# Altium project Soldeer_Station_Seppe_budenaers.PrjPcb
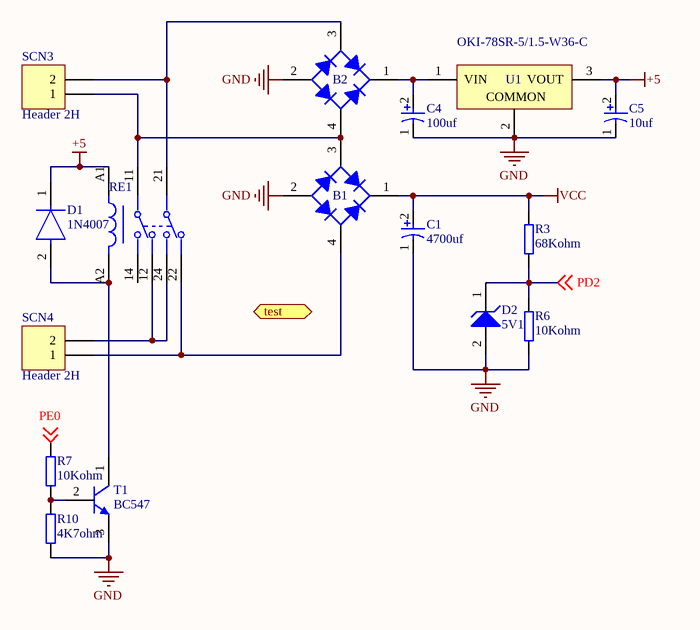
[diagram p0: Voeding.SchDoc]
ME: Seppe Budenaers; PR_number: PXLEAI1001; PR_title: Soldeerstation
5 sheets, 73 parts. Net scope: flat (ports and power ports of the same name join across sheets).
Board file: PCB1.PcbDoc
Sheets:
  Voeding.SchDoc
  Microcontroler.SchDoc
  Soldeerbout_out.SchDoc
  Thermokoppel.SchDoc
  Display.SchDoc

## Sheet Voeding.SchDoc: Soldeerstation
size A4; SheetNumber: 1; SheetTotal: 5

### Parts
B1  Bridge_Rectifier  [ttf]  (value not drawn)
B2  Bridge_Rectifier  [ttf]  (value not drawn)
C1  4700uf  [CE_D25_L25_THT]
C4  100uf  [CE_D8_L10]
C5  10uf  [CE_D4_L5,4]
D1  1N4007  [SOD-123FL]
D2  5V1  [SOD-123FL]
R3  68Kohm  [R_0805_M]
R6  10Kohm  [R_0805_M]
R7  10Kohm  [R_0805_M]
R10  4K7ohm  [R_0805_M]
RE1  RELAY_GENERAL_PURPOSE  [RT42]  (value not drawn)
SCN3  Header 2H  [Connector_2x1_p_5mm]
SCN4  Header 2H  [Connector_2x1_p_5mm]
T1  BC547  [SOT_23]
U1  OKI-78SR-5/1.5-W36-C  [OKI78SR515W36C]

### Ports
test (bidir)

### Nets
+5: C5.2 D1.1(C) RE1.A1 U1.3(VOUT)
GND: B1.2(A) B2.2(A) C1.1 C4.1 C5.1 D2.2(A) R6.2 R10.2 T1.3(E) U1.2(COMMON)
VCC: B1.1(K) C1.2 R3.2
PD2: D2.1(K) R3.1 R6.1 ; off-sheet PD2
PE0: R7.2 ; off-sheet PE0
NetB1_3: B1.3(C) B2.4(C) RE1.11 SCN3.1
NetB1_4: B1.4(C) RE1.22 SCN4.1
NetB2_1: B2.1(K) C4.2 U1.1(VIN)
NetB2_3: B2.3(C) RE1.21 SCN3.2
NetD1_2: D1.2(A) RE1.A2 T1.1(C)
NetR7_1: R7.1 R10.1 T1.2(B)
NetRE1_12: RE1.12 RE1.24 SCN4.2

Not connected (* = marked no-connect by the designer): RE1 14

### Library data of the parts
B1 B2 = Bridge_Rectifier: Manufacturer: Diodes Inc; Average Rectified Current-Max: 0.8A; Reverse Voltage-Max [Vrrm]: 600V; Forward Voltage: 1V; Peak Current-Max: 30A; Reverse Current-Max: 5µA; Package Version: 05/2016; Package URL: http://www.diodes.com/_files/packages/MiniDIP.pdf; Datasheet Version: Rev. 13-2, 12/2010; Datasheet URL: http://www.diodes.com/_files/datasheets/ds17003.pdf; Mounting Technology: SurfaceMount; Manufacturer URL: http://www.diodes.com/; Package Reference: MiniDIP-4; Package Description: 4-Pin Small Outline Integrated Circuit, Body 4.7 x 3.8 mm, Pitch 2.5 mm
C1 C4 C5 = Capacitor_Electrolytic: Manufacturer: Panasonic; Voltage Rating: 25 V; ComponentLink2URL: http://industrial.panasonic.com/cdbs/www-data/pdf/RDE0000/ABA0000C1181.pdf; Height: 10.2 mm; Max Operating Temperature: 105 degC; PackageReference: EEE-FK1E221P; ComponentLink1Description: Manufacturer URL; ComponentLink1URL: http://www.panasonic.com/; Mount: Surface Mount; REACH SVHC: No SVHC; Min Operating Temperature: -55 degC; ComponentLink2Description: Datasheet; DatasheetVersion: 03/2016; Length: 10.2 mm; RoHSCompliant: true; Packaging: Tape and Reel; Package Quantity: 500; Lead Pitch: 3.1 mm; Pins: 2; PackageDescription: 2-Pin Electrolytic Aluminum Capacitor, Body 8.3 x 8.3 mm; Mounting Technology: Surface Mount
D1 = Diode: Manufacturer: Diotec; Max Surge Forward Current: 27A; Forward Current: 1A; Max Junction Temp: +175°C; Reverse Voltage: 1000V; Value: 15pF; Peak Reverse Current: 5uA; Category: Diode; Temperature Range Low: -50°C; Automotive: No; Temperature: -50°C to +175°C; Lead Free: Yes; ComponentLink2Description: Datasheet; Max Repetitive Reverse Voltage: 1000V; ComponentLink2URL: https://datasheet.octopart.com/1N4007-Diotec-datasheet-62346875.pdf; Manufacturer Part Number: 1N4007; Device Class L3: Rectifier Diodes; Height: 2.8mm; Octopart: https://octopart.com/1n4007-diotec-4040411; Package: 1N4007; Temperature Range High: +175°C; Device Class L1: Discrete Semiconductors; Device Class L2: Diodes; RoHS: TRUE; Capacitance: 15pF; Ipc Land Pattern Name: DIOAD888W100L520D280
D2 = Zener_Diode: Manufacturer: On Semiconductor; PartNumber: 1SMB5920BT3G; Packing: Tape and Reel; VZ Typ (V): 6.2; PackageDescription: 2-Pin Small Molded Package, J-Bend Lead, Body 4.33 x 3.625 mm; Mounting Technology: Surface Mount; PackageVersion: Rev. H, 05/2011; ComponentLink1Description: Manufacturer URL; RoHS: Pb-Free; DatasheetVersion: Rev. 8; ComponentLink2Description: Datasheet; ComponentLink2URL: http://www.onsemi.com/pub_link/Collateral/1SMB5913BT3-D.PDF; ComponentLink1URL: http://www.onsemi.com/; ComponentLink3Description: Package Specification; PackageReference: SMB-2-403A-03_H; ComponentLink3URL: http://www.onsemi.com/pub_link/Collateral/1SMB5913BT3-D.PDF
R3 R6 R7 R10 = Resistor: Manufacturer: Vishay Dale; Part Number: CRCW08050000Z0EA
RE1 = RELAY_GENERAL_PURPOSE: Manufacturer Part Number: RT424005; Manufacturer: TE Connectivity; Coil Power: 403mW; Throw Configuration: DPDT; Coil Voltage: 5V; Number Of Contacts: 2; Coil Resistance: 62Ω; Current Rating: 8A; Coil Type: Non-Latching; Category: Relay; Octopart: https://octopart.com/5-1393243-9-te+connectivity-41835766; Device Class L3: Power Relays; ComponentLink2URL: https://www.te.com/commerce/DocumentDelivery/DDEController?Action=showdoc&DocId=Data+Sheet%7FRT2%7F1014%7Fpdf%7FEnglish%7FENG_DS_RT2_1014.pdf%7F5-1393243-9; Ambient Temperature Range High: +85°C; ComponentLink2Description: Datasheet; Digikey Description: RELAY GENERAL PURPOSE DPDT 8A 5V; Package: RT424005; Automotive: No; Device Class L1: Electromechanical; Height: 15.7mm; Device Class L2: Relays; Ambient Temperature Range Low: -40°C; Mouser Description: General Purpose Relay, Rt2 Series, Power, Non Latching, Dpdt, 5 Vdc, 8 A Rohs Compliant: Yes; Lead Free: Yes; RoHS: TRUE
SCN3 SCN4 = Header 2H: ScrewConnector, 2-Pin, Right Angle; LatestRevisionDate: 17-Jul-2002; LatestRevisionNote: Re-released for DXP Platform.; Publisher: Altium Limited
T1 = Transistor_NPN: Manufacturer: On Semiconductor; PartNumber: BC547C; IC Continuous (A): 0.1; fT Min (MHz): 150; Packing: Bulk Box; Polarity: NPN; Mounting Technology: Through Hole; ComponentLink1URL: http://www.onsemi.com/; ComponentLink1Description: Manufacturer URL; ComponentLink3URL: http://www.onsemi.cn/pub_link/Collateral/2N6426-D.PDF; DatasheetVersion: Rev. 7; PackageVersion: Rev. AM; RoHS: FALSE; ComponentLink2URL: http://www.onsemi.com/pub_link/Collateral/BC546-D.PDF; ComponentLink3Description: Package Specification; PackageDescription: 3-Pin Transistor Outline, Body 4.825 x 3.685 mm, Pitch 1.27 mm; PackageReference: TO-92-3-29-11_AM_SL; ComponentLink2Description: Datasheet
U1 = DC/DC Converter: Manufacturer: Murata; Current - Output (Max): 1.5A; Power (Watts) - Max: 8W; Efficiency: 90.5%; Voltage - Input (Min): 7V; Voltage - Input (Max): 36V; Voltage - Output 1: 5V; Number of Outputs: 1; Package / Case: 3-SIPModule; Features: SCP; Type: LinearRegulatorReplacement; Size / Dimension: 0.41"Lx0.30"Wx0.65"H(10.4mmx7.6mmx16.5mm); Datasheet URL: https://datasheet.ciiva.com/8006/1790439-8006672.pdf; Datasheet Version: Oct-13; Power (Watts) - Manufacture Series: 8W; Voltage - Output 2: -; Series: Okami™OKI-78SR; Family: DCDCConverters; Manufacturer URL: http://www.murata.com/; Category: PowerSupplies-BoardMount; Voltage - Isolation: -; Packaging: Tube; Applications: ITE(Commercial); Mounting Type: ThroughHole; Voltage - Output 3: -; Operating Temperature: -40degC~85degC

## Sheet Microcontroler.SchDoc: Soldeerstation
size A4; SheetNumber: 2; SheetTotal: 5
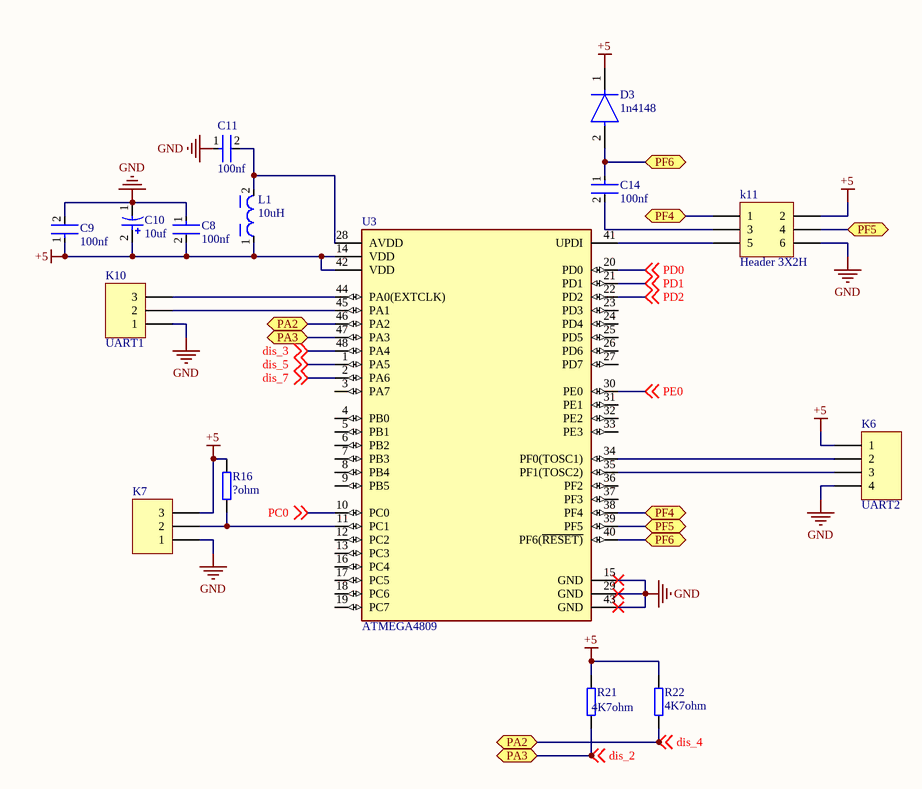
[diagram p1: Microcontroler.SchDoc]

### Parts
C8  100nf  [CC_0805_m]
C9  100nf  [CC_0805_m]
C10  10uf  [CE_D4_L5,4]
C11  100nf  [CC_0805_m]
C14  100nf  [CC_0805_m]
D3  1n4148  [SOD-123FL]
K6  UART2  [MHDR1X4]
K7  Header 3H  [MHDR1X3]  (value not drawn)
K10  UART1  [MHDR1X3]
k11  Header 3X2H  [MHDR2X3]
L1  10uH  [CC_0805_L]
R16  ?ohm  [R_0805_M]
R21  4K7ohm  [R_0805_M]
R22  4K7ohm  [R_0805_M]
U3  ATMEGA4809  [TQFP_48_M]

### Ports
PA2 (bidir), PA3 (bidir), PF4 (bidir), PF5 (bidir), PF6 (bidir)

### Nets
+5: C8.2 C9.1 C10.2 D3.1(C) K6.1 K7.3 k11.2 L1.1 R16.2 R21.2 R22.2 U3.14(VDD) U3.42(VDD)
GND: C8.1 C9.2 C10.1 C11.1 K6.4 K7.1 K10.1 k11.6 U3.15(GND) U3.29(GND) U3.43(GND)
dis_2: R21.1 U3.47(PA3) ; off-sheet dis_2, port PA3
dis_3: U3.48(PA4) ; off-sheet dis_3
dis_4: R22.1 U3.46(PA2) ; off-sheet dis_4, port PA2
dis_5: U3.1(PA5) ; off-sheet dis_5
dis_7: U3.2(PA6) ; off-sheet dis_7
PC0: U3.10(PC0) ; off-sheet PC0
PD0: U3.20(PD0) ; off-sheet PD0
PD1: U3.21(PD1) ; off-sheet PD1
PD2: U3.22(PD2) ; off-sheet PD2
PE0: U3.30(PE0) ; off-sheet PE0
NetC11_2: C11.2 L1.2 U3.28(AVDD)
NetC14_1: C14.1 D3.2(A) U3.40(PF6(~{RESET)}) ; port PF6
NetC14_2: C14.2 k11.3
NetK6_2: K6.2 U3.34(PF0(TOSC1))
NetK6_3: K6.3 U3.35(PF1(TOSC2))
NetK7_2: K7.2 R16.1 U3.11(PC1)
NetK10_2: K10.2 U3.45(PA1)
NetK10_3: K10.3 U3.44(PA0(EXTCLK))
Netk11_1: k11.1 U3.38(PF4) ; port PF4
Netk11_4: k11.4 U3.39(PF5) ; port PF5
Netk11_5: k11.5 U3.41(UPDI)

Not connected (* = marked no-connect by the designer): U3 3(PA7) 4(PB0) 5(PB1) 6(PB2) 7(PB3) 8(PB4) 9(PB5) 12(PC2) 13(PC3) 16(PC4) 17(PC5) 18(PC6) 19(PC7) 23(PD3) 24(PD4) 25(PD5) 26(PD6) 27(PD7) 31(PE1) 32(PE2) 33(PE3) 36(PF2) 37(PF3)

### Library data of the parts
C8 C9 C11 C14 = Capacitor_Ceramic: Manufacturer: KEMET; Manufacturer Part Number: C0805C224K5RACTU; Value: 0.22 μF; Temperature Characteristic: X7R; Temperature Coefficient: 30ppm/°C; Tolerance: 0.1; Voltage Rating: 50 V; ComponentLink2URL: https://content.kemet.com/datasheets/KEM_C1003_C0G_SMD.pdf; Device Class L3: Ceramic Capacitors; Lead Free: Yes; Temperature: -55°C to +125°C; RoHS: TRUE; Capacitance: 0.22 μF; Automotive: No; Material: Ceramic; Octopart: https://octopart.com/c0805c224k5ractu-kemet-144670; Temperature Range Low: -55°C; Height: 0.88mm; Device Class L1: Passive Components; Digikey Description: CAP CER 0.22UF 50V X7R 0805; ComponentLink2Description: Datasheet; Mouser Description: CAP CER 0.22UF 50V X7R 0805; Category: Cap; Ipc Land Pattern Name: CAPC200125X78; Temperature Range High: +125°C; Package: C0805C-DN; Device Class L2: Capacitors
C10 = Capacitor_Electrolytic: as C1 on sheet Voeding; ComponentLink2URL: http://industrial.panasonic.com/cdbs/www-data/pdf/RDE0000/ABA0000C1181.pdf; Height: 10.2 mm; Max Operating Temperature: 105 degC; PackageReference: EEE-FK1E221P; ComponentLink1Description: Manufacturer URL; ComponentLink1URL: http://www.panasonic.com/; Mount: Surface Mount; REACH SVHC: No SVHC; Min Operating Temperature: -55 degC; ComponentLink2Description: Datasheet; DatasheetVersion: 03/2016; Length: 10.2 mm; RoHSCompliant: true; Packaging: Tape and Reel; Package Quantity: 500; Lead Pitch: 3.1 mm; Pins: 2; PackageDescription: 2-Pin Electrolytic Aluminum Capacitor, Body 8.3 x 8.3 mm; Mounting Technology: Surface Mount
D3 = Diode: Manufacturer Part Number: 1N4007; Manufacturer: Diotec; Max Surge Forward Current: 27A; Forward Current: 1A; Max Junction Temp: +175°C; Reverse Voltage: 1000V; Value: 15pF; Peak Reverse Current: 5uA; Category: Diode; Temperature Range Low: -50°C; Automotive: No; Temperature: -50°C to +175°C; Lead Free: Yes; ComponentLink2Description: Datasheet; Max Repetitive Reverse Voltage: 1000V; ComponentLink2URL: https://datasheet.octopart.com/1N4007-Diotec-datasheet-62346875.pdf; Device Class L3: Rectifier Diodes; Height: 2.8mm; Octopart: https://octopart.com/1n4007-diotec-4040411; Package: 1N4007; Temperature Range High: +175°C; Device Class L1: Discrete Semiconductors; Device Class L2: Diodes; RoHS: TRUE; Capacitance: 15pF; Ipc Land Pattern Name: DIOAD888W100L520D280
K6 = Header 4H: Header, 4-Pin, Right Angle; LatestRevisionDate: 17-Jul-2002; LatestRevisionNote: Re-released for DXP Platform.; Publisher: Altium Limited
K7 K10 = Header 3H: Header, 3-Pin, Right Angle; LatestRevisionDate: 17-Jul-2002; LatestRevisionNote: Re-released for DXP Platform.; Publisher: Altium Limited
k11 = Header 3X2H: Header, 3-Pin, Dual row, Right Angle; LatestRevisionDate: 17-Jul-2002; LatestRevisionNote: Re-released for DXP Platform.; Publisher: Altium Limited
L1 = Choke: Tolerance: 20%; Shielding: Shielded; Saturation Current: 10A; Test Frequency: 100kHz; RMS Current (Irms): 8.5A; Series Resistance: 14.1R; DC Resistance (DCR): 14.1mR; Self Resonant Frequency: 18MHz; Ratings: AEC-Q200; Width: 12.8mm; Series: WE-HCI; Length: 0.512inch; Mount: Surface Mount; Resistor Type: Wirewound; RoHS Compliant: Yes; Inductance: 10uH; Package Quantity: 1; Min Operating Temperature: -40°C; Inductance Tolerance: 20%; Termination: SMD/SMT; Max DC Current: 8.5A; Height - Seated (Max): 0.197inch; Case/Package: 1350; Current Rating: 8.5A; Max Operating Temperature: 155°C; Packaging: Tape and Reel; Height: 4.7mm
R16 R21 R22 = Resistor: as R3 on sheet Voeding
U3 = ATMEGA4809: Peripherals: Brown-out Detect/Reset; Number of I/Os: 41; Core Architecture: AVR; Memory Size: 48KB; Interface: I2C; Oscillator Type: Internal; Memory Type: FLASH; Series: megaAVR® 0, Functional Safety (FuSa); Min Operating Temperature: -40°C; Mount: Surface Mount; Case/Package: TQFP; RoHS Compliant: Yes; Max Operating Temperature: 85°C

## Sheet Soldeerbout_out.SchDoc: Soldeerstation
size A4; SheetNumber: 3; SheetTotal: 5
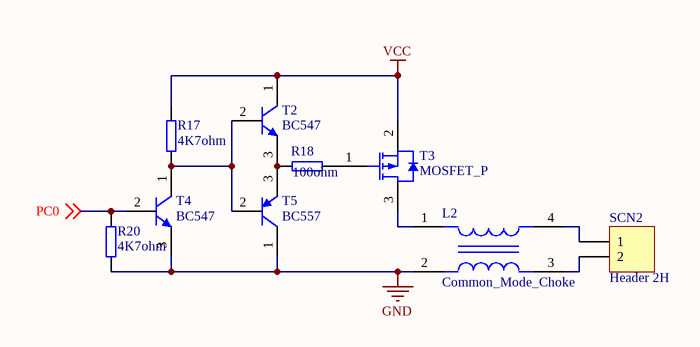
[diagram p2: Soldeerbout_out.SchDoc]

### Parts
L2  Common_Mode_Choke  [2545]
R17  4K7ohm  [R_0805_M]
R18  100ohm  [R_0805_M]
R20  4K7ohm  [R_0805_M]
SCN2  Header 2H  [Connector_2x1_p_5mm]
T2  BC547  [SOT_23]
T3  MOSFET_P  [TO_252]
T4  BC547  [SOT_23]
T5  BC557  [SOT_23]

### Nets
GND: L2.2 R20.1 T4.3(E) T5.1(C)
VCC: R17.2 T2.1(C) T3.2(SOURCE)
PC0: R20.2 T4.2(B) ; off-sheet PC0
NetL2_1: L2.1 T3.3(DRAIN)
NetL2_3: L2.3 SCN2.2
NetL2_4: L2.4 SCN2.1
NetR17_1: R17.1 T2.2(B) T4.1(C) T5.2(B)
NetR18_1: R18.1 T2.3(E) T5.3(E)
NetR18_2: R18.2 T3.1(GATE)

### Library data of the parts
L2 = Common_Mode_Choke: Max Current Rating: 2A; Number of Lines: 2; Impedance: 900R; Element Configuration: Dual; Insulation Resistance: 10MR; Test Frequency: 100MHz; DC Resistance (DCR): 60mR; Voltage Rating (DC): 50V; Current Rating: 2.3A; Number of Pins: 4; DC Current: 2A; Mount: Surface Mount; Current: 2A; REACH SVHC: No SVHC; Width: 4.5mm; Case/Package: 1808; Voltage Rating: 50V; Package Quantity: 1; Height: 2mm; Max DC Current: 2A; Packaging: Tape and Reel; Max Operating Temperature: 85°C; Lead Free: Lead Free; Length: 0.185inch; Series: ACM; Radiation Hardening: No; Max Voltage Rating (DC): 50V; Termination: Flat; Depth: 4.7mm; RoHS Compliant: Yes; DC Resistance-Max: 60mR; Min Operating Temperature: -40°C
R17 R18 R20 = Resistor: as R3 on sheet Voeding
SCN2 = Header 2H: screwconnector, 2-Pin, Right Angle; LatestRevisionDate: 17-Jul-2002; LatestRevisionNote: Re-released for DXP Platform.; Publisher: Altium Limited
T2 T4 = Transistor_NPN: as T1 on sheet Voeding; Mounting Technology: Through Hole; ComponentLink1URL: http://www.onsemi.com/; ComponentLink1Description: Manufacturer URL; ComponentLink3URL: http://www.onsemi.cn/pub_link/Collateral/2N6426-D.PDF; DatasheetVersion: Rev. 7; PackageVersion: Rev. AM; RoHS: FALSE; ComponentLink2URL: http://www.onsemi.com/pub_link/Collateral/BC546-D.PDF; ComponentLink3Description: Package Specification; PackageDescription: 3-Pin Transistor Outline, Body 4.825 x 3.685 mm, Pitch 1.27 mm; PackageReference: TO-92-3-29-11_AM_SL; ComponentLink2Description: Datasheet
T3 = MOSFET_P: Manufacturer: Fairchild Semiconductor; Reel Quantity: 3000; Drain Source Voltage Vds: 20V; Power Dissipation Pd: 500mW; On Resistance Rds(on): 52mohm; Full Power Rating Temperature: 25°C; Voltage Vgs Max: -800mV; Pulse Current Idm: 10A; Rds(on) Test Voltage Vgs: -4.5V; External Depth: 2.5mm; Transistor Case Style: SOT-23; No. of Pins: 3; Continuous Drain Current Id: 2.4A; Voltage Vds Typ: -20V; Voltage Vgs th Max: -1.5V; Transistor Polarity: PChannel; Package Version: Rev. 3, 05/2015; External Width: 3.05mm; External Length / Height: 1.12mm; SMD Marking: 304P; SVHC: NoSVHC(19-Dec-2012); Termination Type: SMD; Datasheet URL: https://www.fairchildsemi.com/datasheets/FD/FDN304P.pdf; Tape Width: 8mm; Mounting Technology: SurfaceMount; Voltage Vgs Rds on Measurement: -4.5V; Operating Temperature Range: -55°Cto+150°C; Current Temperature: 25°C; Operating Temperature Min: -55°C; Threshold Voltage Vgs Typ: -800mV; Package / Case: SOT-23; Manufacturer URL: https://www.fairchildsemi.com/; Voltage Vds: 20V; Datasheet Version: Rev. C, 01/2001; Operating Temperature Max: 150°C; Package Description: 3-Pin Small Outline Transistor, Body 2.92 x 1.4 mm, Pitch 0.95 mm; Current Id Max: 2.4A; Package URL: https://www.fairchildsemi.com/package-drawings/MA/MA03B.pdf; Package Reference: SSOT3L
T5 = Transistor_PNP: Manufacturer: On Semiconductor; PartNumber: BC557C; Polarity: PNP; IC Continuous (A): -0.1; Packing: Bulk Box; PackageVersion: Rev. AM; RoHS: FALSE; PackageDescription: 3-Pin Transistor Outline, Body 4.825 x 3.685 mm, Pitch 1.27 mm; ComponentLink2Description: Datasheet; DatasheetVersion: Rev. 3; ComponentLink3Description: Package Specification; Mounting Technology: Through Hole; ComponentLink2URL: http://www.onsemi.com/pub_link/Collateral/BC556B-D.PDF; ComponentLink1URL: http://www.onsemi.com/; ComponentLink1Description: Manufacturer URL; ComponentLink3URL: http://www.onsemi.cn/pub_link/Collateral/2N6426-D.PDF; PackageReference: TO-92-3-29-11_AM_SL

## Sheet Thermokoppel.SchDoc: Soldeerstation
size A4; SheetNumber: 4; SheetTotal: 5; SPICEModelCacheXJIMZCRK: <root> / <DocumentId>XJIMZCRK</DocumentId> / <CacheFrame Number="0"> / <Model Name="pnp" Kind="MDL"> / <Text>*Default PNP BJT / *PNP Trans Pinout: C,B,E / .MODEL PNP PNP()</Text> / </Model> / </CacheFrame> / </root>
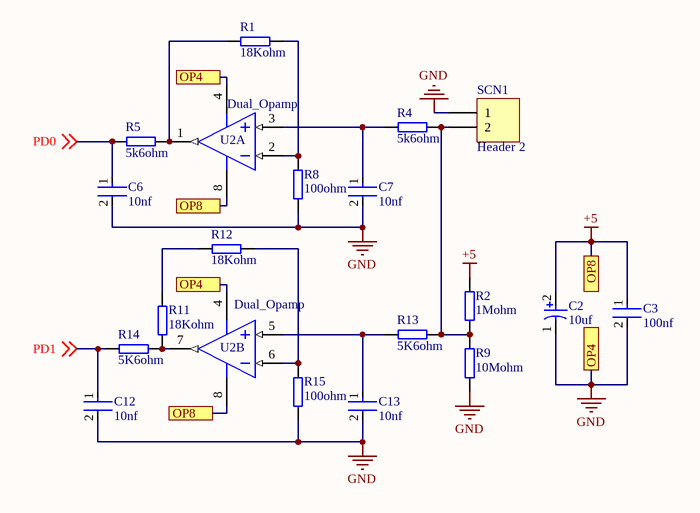
[diagram p3: Thermokoppel.SchDoc]

### Parts
C2  10uf  [CE_D4_L5,4]
C3  100nf  [CC_0805_m]
C6  10nf  [CC_0805_m]
C7  10nf  [CC_0805_m]
C12  10nf  [CC_0805_m]
C13  10nf  [CC_0805_m]
R1  18Kohm  [R_0805_M]
R2  1Mohm  [R_0805_M]
R4  5k6ohm  [R_0805_M]
R5  5k6ohm  [R_0805_M]
R8  100ohm  [R_0805_M]
R9  10Mohm  [R_0805_M]
R11  18Kohm  [R_0805_M]
R12  18Kohm  [R_0805_M]
R13  5K6ohm  [R_0805_M]
R14  5K6ohm  [R_0805_M]
R15  100ohm  [R_0805_M]
SCN1  Header 2  [Connector_2x1_p_5mm]
U2  Dual_Opamp  [MSOP_8_M]  (parts A,B of 2)

### Ports
OP4, OP8

### Nets
+5: C2.2 C3.1 R2.2 U2.8(VDD) ; port OP8
GND: C2.1 C3.2 C6.2 C7.2 C12.2 C13.2 R8.1 R9.1 R15.1 SCN1.1 U2.4(VSS) ; port OP4
PD0: C6.1 R5.1 ; off-sheet PD0
PD1: C12.1 R14.1 ; off-sheet PD1
NetC7_1: C7.1 R4.1 U2.3(VINA+)
NetC13_1: C13.1 R13.1 U2.5(VINB+)
NetR1_1: R1.1 R5.2 U2.1(VOUTA)
NetR1_2: R1.2 R8.2 U2.2(VINA-)
NetR2_1: R2.1 R4.2 R9.2 R13.2 SCN1.2
NetR11_1: R11.1 R14.2 U2.7(VOUTB)
NetR11_2: R11.2 R12.1
NetR12_2: R12.2 R15.2 U2.6(VINB-)

### Library data of the parts
C2 = Capacitor_Electrolytic: as C1 on sheet Voeding; ComponentLink2URL: http://industrial.panasonic.com/cdbs/www-data/pdf/RDE0000/ABA0000C1181.pdf; Height: 10.2 mm; Max Operating Temperature: 105 degC; PackageReference: EEE-FK1E221P; ComponentLink1Description: Manufacturer URL; ComponentLink1URL: http://www.panasonic.com/; Mount: Surface Mount; REACH SVHC: No SVHC; Min Operating Temperature: -55 degC; ComponentLink2Description: Datasheet; DatasheetVersion: 03/2016; Length: 10.2 mm; RoHSCompliant: true; Packaging: Tape and Reel; Package Quantity: 500; Lead Pitch: 3.1 mm; Pins: 2; PackageDescription: 2-Pin Electrolytic Aluminum Capacitor, Body 8.3 x 8.3 mm; Mounting Technology: Surface Mount
C3 C6 C7 C12 C13 = Capacitor_Ceramic: as C8 on sheet Microcontroler; ComponentLink2URL: https://content.kemet.com/datasheets/KEM_C1003_C0G_SMD.pdf; Device Class L3: Ceramic Capacitors; Lead Free: Yes; Temperature: -55°C to +125°C; RoHS: TRUE; Capacitance: 0.22 μF; Automotive: No; Material: Ceramic; Octopart: https://octopart.com/c0805c224k5ractu-kemet-144670; Temperature Range Low: -55°C; Height: 0.88mm; Device Class L1: Passive Components; Digikey Description: CAP CER 0.22UF 50V X7R 0805; ComponentLink2Description: Datasheet; Mouser Description: CAP CER 0.22UF 50V X7R 0805; Category: Cap; Ipc Land Pattern Name: CAPC200125X78; Temperature Range High: +125°C; Package: C0805C-DN; Device Class L2: Capacitors
R1 R2 R4 R5 R8 R9 R11-R15 = Resistor: as R3 on sheet Voeding
SCN1 = Header 2: ScrewConnector, 2-Pin; LatestRevisionDate: 17-Jul-2002; LatestRevisionNote: Re-released for DXP Platform.; Publisher: Altium Limited
U2 = Dual_Opamp: Slew Rate: 0.6V/µs; Supply Current: 100uA; Power Supply Rejection Ratio (PSRR): 86dB; Input Offset Voltage (Vos): 4.5mV; Input Bias Current: 1pA; Amplifier Type: GENERAL PURPOSE; Unity Gain Bandwidth Product: 1MHz; Number of Circuits: 2; Output Current: 23mA; Operating Supply Voltage: 5.5V; Min Supply Voltage: 1.8V; Common Mode Rejection Ratio: 60dB; Voltage Gain: 112dB; Max Supply Voltage: 6V; Package Quantity: 60; REACH SVHC: No SVHC; Min Operating Temperature: -40°C; Max Operating Temperature: 125°C; Mount: Through Hole; Nominal Supply Current: 100uA; Height: 3.3mm; Length: 9.27mm; Slew Rate-Nom: 0.6V/µs; Packaging: Rail/Tube; Output Current per Channel: 23mA; Number of Amplifiers: 2; RoHS Compliant: Yes; Radiation Hardening: No; Bandwidth: 1MHz; Lead Free: Lead Free; Width: 6.35mm; Number of Channels: 2; Gain Bandwidth Product: 1MHz; Technology: CMOS; Operating Supply Current: 100uA; Number of Elements: 2; Number of Pins: 8; Input Offset Voltage-Max: 4.5mV; Case/Package: PDIP

## Sheet Display.SchDoc: Soldeerstation
size A4; SheetNumber: 5; SheetTotal: 5
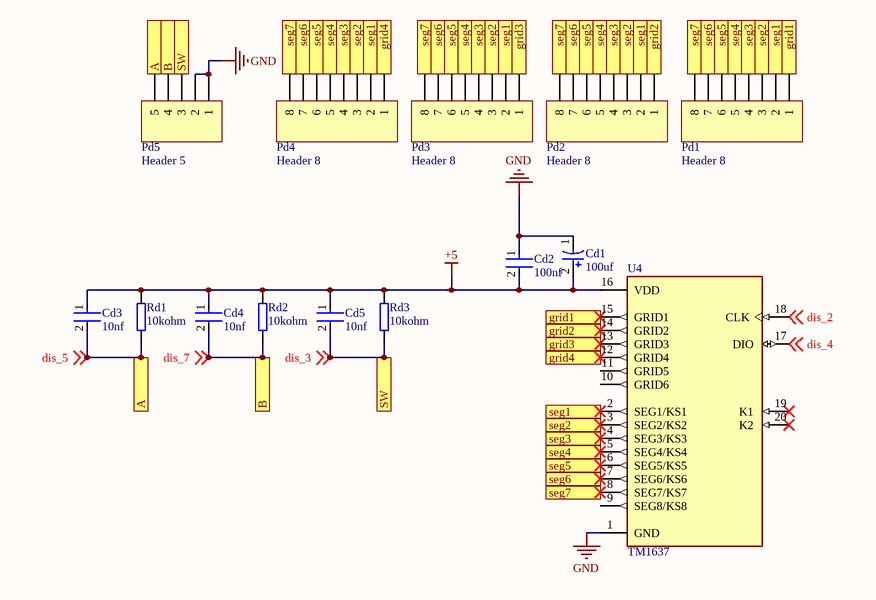
[diagram p4: Display.SchDoc]

### Parts
Cd1  100uf  [CE_D8_L10]
Cd2  100nf  [CC_0805_L]
Cd3  10nf  [CC_0805_L]
Cd4  10nf  [CC_0805_L]
Cd5  10nf  [CC_0805_L]
Pd1  Header 8  [HDR1X8]
Pd2  Header 8  [HDR1X8]
Pd3  Header 8  [HDR1X8]
Pd4  Header 8  [HDR1X8]
Pd5  Header 5  [HDR1X5]
Rd1  10kohm  [R_0805_L]
Rd2  10kohm  [R_0805_L]
Rd3  10kohm  [R_0805_L]
U4  TM1637  [SOP_20_M]

### Ports
A, B, grid1, grid2, grid3, grid4, seg1, seg2, seg3, seg4, seg5, seg6, seg7, SW

### Nets
+5: Cd1.2 Cd2.2 Cd3.1 Cd4.1 Cd5.1 Rd1.2 Rd2.2 Rd3.2 U4.16(VDD)
GND: Cd1.1 Cd2.1 Pd5.1 Pd5.2 U4.1(GND)
dis_2: U4.18(CLK) ; off-sheet dis_2
dis_3: Cd5.2 Pd5.3 Rd3.1 ; off-sheet dis_3, port SW
dis_4: U4.17(DIO) ; off-sheet dis_4
dis_5: Cd3.2 Pd5.5 Rd1.1 ; off-sheet dis_5, port A
dis_7: Cd4.2 Pd5.4 Rd2.1 ; off-sheet dis_7, port B
NetPd1_1: Pd1.1 U4.15(GRID1) ; port grid1
NetPd1_2: Pd1.2 Pd2.2 Pd3.2 Pd4.2 U4.2(SEG1/KS1) ; port seg1
NetPd1_3: Pd1.3 Pd2.3 Pd3.3 Pd4.3 U4.3(SEG2/KS2) ; port seg2
NetPd1_4: Pd1.4 Pd2.4 Pd3.4 Pd4.4 U4.4(SEG3/KS3) ; port seg3
NetPd1_5: Pd1.5 Pd2.5 Pd3.5 Pd4.5 U4.5(SEG4/KS4) ; port seg4
NetPd1_6: Pd1.6 Pd2.6 Pd3.6 Pd4.6 U4.6(SEG5/KS5) ; port seg5
NetPd1_7: Pd1.7 Pd2.7 Pd3.7 Pd4.7 U4.7(SEG6/KS6) ; port seg6
NetPd1_8: Pd1.8 Pd2.8 Pd3.8 Pd4.8 U4.8(SEG7/KS7) ; port seg7
NetPd2_1: Pd2.1 U4.14(GRID2) ; port grid2
NetPd3_1: Pd3.1 U4.13(GRID3) ; port grid3
NetPd4_1: Pd4.1 U4.12(GRID4) ; port grid4

Not connected (* = marked no-connect by the designer): U4 9(SEG8/KS8) 10(GRID6) 11(GRID5) 19(K1)* 20(K2)*

### Library data of the parts
Cd1 = Capacitor_Electrolytic: as C1 on sheet Voeding; ComponentLink2URL: http://industrial.panasonic.com/cdbs/www-data/pdf/RDE0000/ABA0000C1181.pdf; Height: 10.2 mm; Max Operating Temperature: 105 degC; PackageReference: EEE-FK1E221P; ComponentLink1Description: Manufacturer URL; ComponentLink1URL: http://www.panasonic.com/; Mount: Surface Mount; REACH SVHC: No SVHC; Min Operating Temperature: -55 degC; ComponentLink2Description: Datasheet; DatasheetVersion: 03/2016; Length: 10.2 mm; RoHSCompliant: true; Packaging: Tape and Reel; Package Quantity: 500; Lead Pitch: 3.1 mm; Pins: 2; PackageDescription: 2-Pin Electrolytic Aluminum Capacitor, Body 8.3 x 8.3 mm; Mounting Technology: Surface Mount
Cd2-Cd5 = Capacitor_Ceramic: as C8 on sheet Microcontroler; ComponentLink2URL: https://content.kemet.com/datasheets/KEM_C1003_C0G_SMD.pdf; Device Class L3: Ceramic Capacitors; Lead Free: Yes; Temperature: -55°C to +125°C; RoHS: TRUE; Capacitance: 0.22 μF; Automotive: No; Material: Ceramic; Octopart: https://octopart.com/c0805c224k5ractu-kemet-144670; Temperature Range Low: -55°C; Height: 0.88mm; Device Class L1: Passive Components; Digikey Description: CAP CER 0.22UF 50V X7R 0805; ComponentLink2Description: Datasheet; Mouser Description: CAP CER 0.22UF 50V X7R 0805; Category: Cap; Ipc Land Pattern Name: CAPC200125X78; Temperature Range High: +125°C; Package: C0805C-DN; Device Class L2: Capacitors
Pd1-Pd4 = Header 8: Header, 8-Pin; LatestRevisionDate: 17-Jul-2002; LatestRevisionNote: Re-released for DXP Platform.; Publisher: Altium Limited
Pd5 = Header 5: Header, 5-Pin; LatestRevisionDate: 17-Jul-2002; LatestRevisionNote: Re-released for DXP Platform.; Publisher: Altium Limited
Rd1-Rd3 = Resistor: as R3 on sheet Voeding
U4 = TM1637: LED Drive Control Special Circuit; MF: Titan Micro Electronics; Package: Package; Availability: Not in stock; SnapEDA_Link: https://www.snapeda.com/parts/TM1637/Titan+Micro+Electronics/view-part/?ref=snap; MP: TM1637; Check_prices: https://www.snapeda.com/parts/TM1637/Titan+Micro+Electronics/view-part/?ref=eda; Value: *; Price: None

## Nets that join several sheets
+5: Voeding (C5.2 D1.1 RE1.A1 U1.3), Microcontroler (13 pins), Thermokoppel (C2.2 C3.1 R2.2 U2.8), Display (9 pins)
GND: Voeding (10 pins), Microcontroler (11 pins), Soldeerbout_out (L2.2 R20.1 T4.3 T5.1), Thermokoppel (11 pins), Display (5 pins)
VCC: Voeding (B1.1 C1.2 R3.2), Soldeerbout_out (R17.2 T2.1 T3.2)
dis_2: Microcontroler (R21.1 U3.47), Display (U4.18)
dis_3: Microcontroler (U3.48), Display (Cd5.2 Pd5.3 Rd3.1)
dis_4: Microcontroler (R22.1 U3.46), Display (U4.17)
dis_5: Microcontroler (U3.1), Display (Cd3.2 Pd5.5 Rd1.1)
dis_7: Microcontroler (U3.2), Display (Cd4.2 Pd5.4 Rd2.1)
PC0: Microcontroler (U3.10), Soldeerbout_out (R20.2 T4.2)
PD0: Microcontroler (U3.20), Thermokoppel (C6.1 R5.1)
PD1: Microcontroler (U3.21), Thermokoppel (C12.1 R14.1)
PD2: Voeding (D2.1 R3.1 R6.1), Microcontroler (U3.22)
PE0: Voeding (R7.2), Microcontroler (U3.30)